# Altium schematic sheet LTE+GPS.SchDoc
size 420 x 297 mm
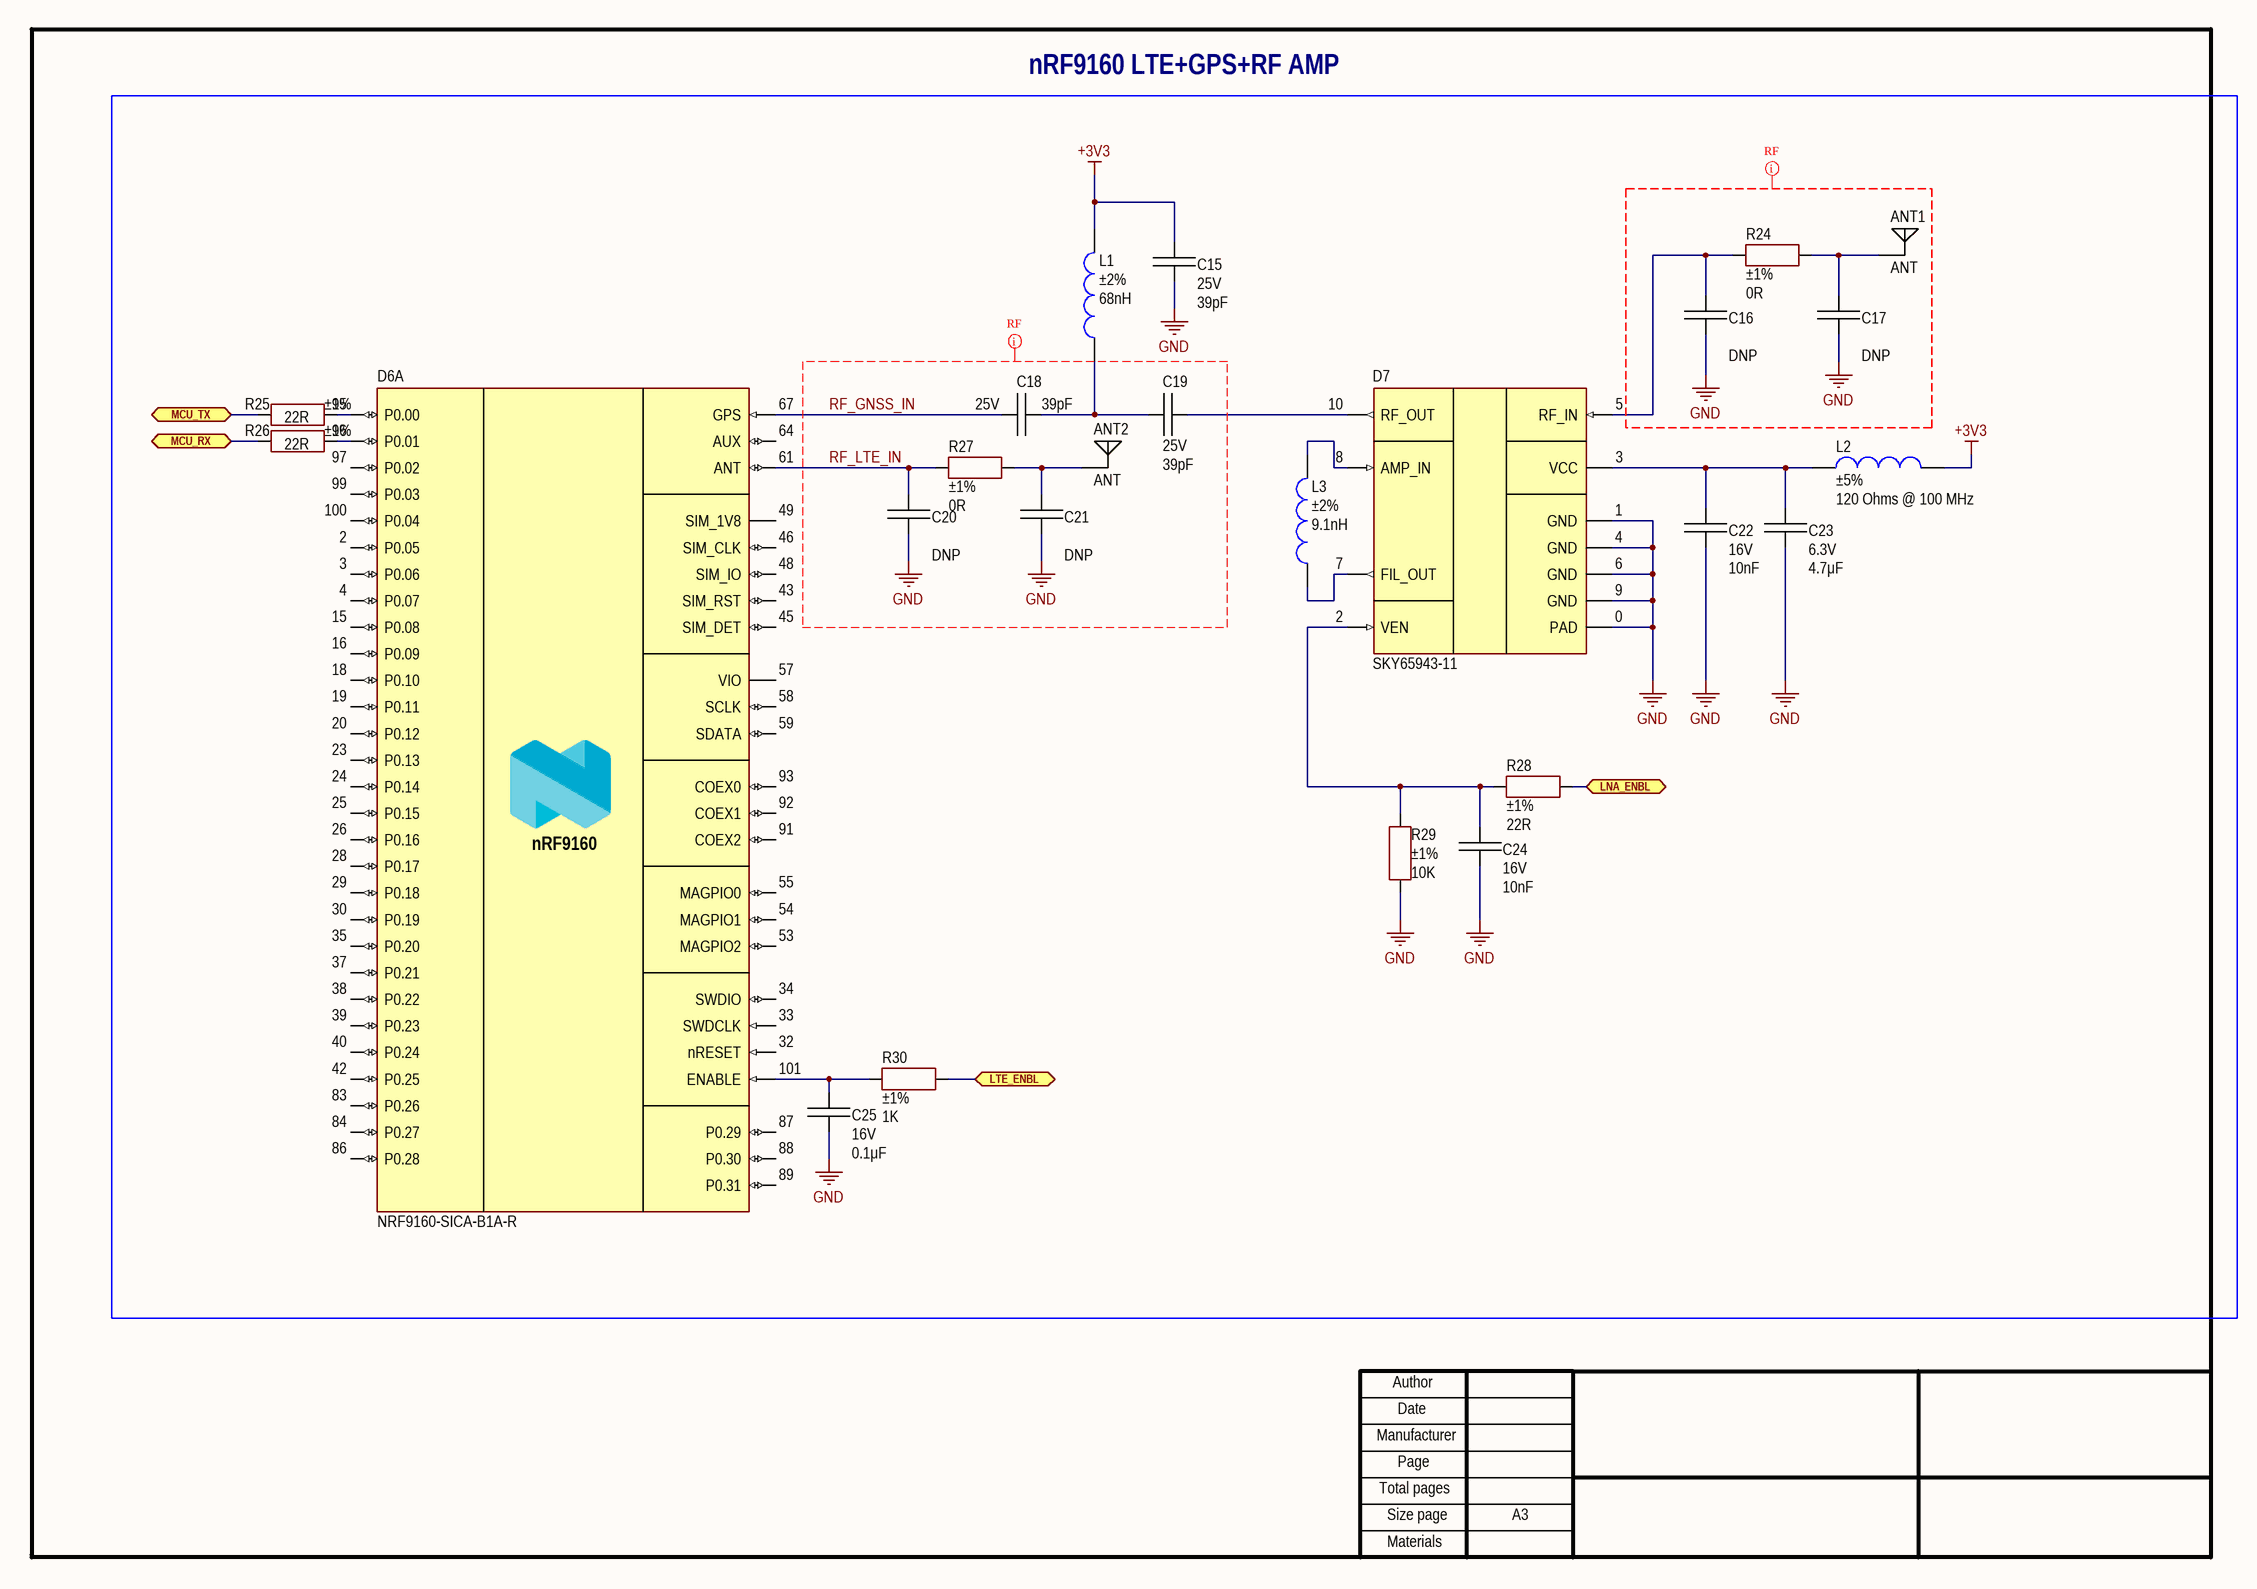
[diagram p0: LTE+GPS.SchDoc]

## Parts
ANT1  CommentText: ANT  [ANT: ANT2012LL00R2400A]
ANT2  CommentText: ANT  [ANT: ANT2012LL00R2400A]
C15  value 39pF  Voltage: 25V  [CAP: 0201]
C16  value DNP  [CAP: 0201]
C17  value DNP  [CAP: 0201]
C18  value 39pF  Voltage: 25V  [CAP: 0201]
C19  value 39pF  Voltage: 25V  [CAP: 0201]
C20  value DNP  [CAP: 0201]
C21  value DNP  [CAP: 0201]
C22  value 10nF  Voltage: 16V  [CAP: 0201]
C23  value 4.7μF  Voltage: 6.3V  [CAP: 0603_NO_SILK]
C24  value 10nF  Voltage: 16V  [CAP: 0201]
C25  value 0.1μF  Voltage: 16V  [CAP: 0402_NO_SILK]
D6  PartNumber: NRF9160-SICA-B1A-R  [MOD: NRF9160]  (part A of 3)
D7  (no value)  [IC: SKY65943-11]
L1  value 68nH  Tolerance: ±2%  [IND: 0402]
L2  value 120 Ohms @ 100 MHz  Tolerance: ±5%  [IND: 0402]
L3  value 9.1nH  Tolerance: ±2%  [IND: 0402]
R24  value 0R  Tolerance: ±1%  [RES: 0201]
R25  value 22R  Tolerance: ±1%  [RES: 0201]
R26  value 22R  Tolerance: ±1%  [RES: 0201]
R27  value 0R  Tolerance: ±1%  [RES: 0201]
R28  value 22R  Tolerance: ±1%  [RES: 0201]
R29  value 10K  Tolerance: ±1%  [RES: 0201]
R30  value 1K  Tolerance: ±1%  [RES: 0201]

## Blocks framed on the sheet
nRF9160 LTE+GPS+RF AMP: ANT1 ANT2 C15-C25 D6 D7 L1-L3 R24-R30

## Ports
LNA_ENBL (bidir), LTE_ENBL (bidir), MCU_RX (bidir), MCU_TX (bidir)

## Nets
+3V3: C15.1 L1.1 L2.1
GND: C15.2 C16.1 C17.1 C20.1 C21.1 C22.1 C23.1 C24.1 C25.1 D7.0(PAD) D7.1(GND) D7.4(GND) D7.6(GND) D7.9(GND) R29.1
LNA_ENBL: R28.2 ; port LNA_ENBL
LTE_ENBL: R30.1 ; port LTE_ENBL
MCU_RX: R26.2 ; port MCU_RX
MCU_TX: R25.2 ; port MCU_TX
RF_GNSS_IN: C18.2 D6.67(GPS)
RF_LTE_IN: C20.2 D6.61(ANT) R27.2
NetANT1_1: ANT1.1 C17.2 R24.1
NetANT2_1: ANT2.1 C21.2 R27.1
NetC16_2: C16.2 D7.5(RF_IN) R24.2
NetC18_1: C18.1 C19.2 L1.2
NetC19_1: C19.1 D7.10(RF_OUT)
NetC22_2: C22.2 C23.2 D7.3(VCC) L2.2
NetC24_2: C24.2 D7.2(VEN) R28.1 R29.2
NetC25_2: C25.2 D6.101(ENABLE) R30.2
NetD6_95: D6.95(P0.00) R25.1
NetD6_96: D6.96(P0.01) R26.1
NetD7_7: D7.7(FIL_OUT) L3.2
NetD7_8: D7.8(AMP_IN) L3.1

Not connected (* = marked no-connect by the designer): D6 2(P0.05) 3(P0.06) 4(P0.07) 15(P0.08) 16(P0.09) 18(P0.10) 19(P0.11) 20(P0.12) 23(P0.13) 24(P0.14) 25(P0.15) 26(P0.16) 28(P0.17) 29(P0.18) 30(P0.19) 32(nRESET) 33(SWDCLK) 34(SWDIO) 35(P0.20) 37(P0.21) 38(P0.22) 39(P0.23) 40(P0.24) 42(P0.25) 43(SIM_RST) 45(SIM_DET) 46(SIM_CLK) 48(SIM_IO) 49(SIM_1V8) 53(MAGPIO2) 54(MAGPIO1) 55(MAGPIO0) 57(VIO) 58(SCLK) 59(SDATA) 64(AUX) 83(P0.26) 84(P0.27) 86(P0.28) 87(P0.29) 88(P0.30) 89(P0.31) 91(COEX2) 92(COEX1) 93(COEX0) 97(P0.02) 99(P0.03) 100(P0.04)

## Layout directives
net class RF: GND, RF_GNSS_IN, RF_LTE_IN

## Notes on the sheet
- Author
- Manufacturer
- Date
- Page
- Total pages
- Size page
- A3
- Materials

## Library data of the parts
ANT1 ANT2 = ANT2012LL00R2400A: 2.45GHz Bluetooth, ISM, Wi-Fi, Zigbee Chip RF Antenna 2.4GHz ~ 2.5GHz 3.77dBi Solder Surface Mount; Manufacturer: Yageo; ValueManufacturerPartNumber: Ceramic antenna, 2x1.25mm; HelpURL: https://www.digikey.com/en/products/detail/yageo/ANT2012LL00R2400A/9360375; Type: Ceramic antenna; PartNumber: ANT2012LL00R2400A; Package: 2x1.25mm
C15 C18 C19 = Ceramic_0201: 39 pF ±5% 25V Ceramic Capacitor C0G, NP0 0201 (0603 Metric); Manufacturer: Murata Electronics; PartNumber: GRM0335C1E390JA01D; ValueManufacturerPartNumber: Ceramic capacitor, 39pF, NP0, ±5%, 25V, 0201, -55...+125°C; Package: 0201; HelpURL: https://www.digikey.com/en/products/detail/murata-electronics/GRM0335C1E390JA01D/4358216; Temperature: -55...+125°C; TypeCapacitor: Ceramic capacitor; Tolerance: ±5%; TypeDielectric: NP0
C16 C17 C20 C21 = Ceramic_0201: DNP; ValueManufacturerPartNumber: Ceramic capacitor, DNP, , , , 0201, -55...+125°C; TypeCapacitor: Ceramic capacitor; Package: 0201; Temperature: -55...+125°C
C22 C24 = Ceramic_0201: 10000 pF ±10% 16V Ceramic Capacitor X7R 0201 (0603 Metric); Manufacturer: Yageo; PartNumber: CC0201KRX7R7BB103; ValueManufacturerPartNumber: Ceramic capacitor, 10nF, X7R, ±10%, 16V, 0201, -55...+125°C; Package: 0201; HelpURL: https://www.digikey.com/en/products/detail/yageo/CC0201KRX7R7BB103/2833569; Temperature: -55...+125°C; TypeCapacitor: Ceramic capacitor; Tolerance: ±10%; TypeDielectric: X7R
C23 = Ceramic_0603: 4.7 µF ±20% 6.3V Ceramic Capacitor X7R 0603 (1608 Metric); Manufacturer: Yageo; PartNumber: CC0603MRX7R5BB475; ValueManufacturerPartNumber: Ceramic capacitor, 4.7μF, X7R, ±10%, 6.3V, 0603, -55...+125°C; Tolerance: ±10%; Package: 0603; HelpURL: https://www.digikey.com/en/products/detail/yageo/CC0603MRX7R5BB475/7164380; Temperature: -55...+125°C; TypeCapacitor: Ceramic capacitor; TypeDielectric: X7R
C25 = Ceramic_0402: 0.1 µF ±10% 16V Ceramic Capacitor X7R 0402 (1005 Metric); Manufacturer: Yageo; PartNumber: CC0402KRX7R7BB104; ValueManufacturerPartNumber: Ceramic capacitor, 0.1μF, X7R, ±10%, 16V, 0402, -55...+125°C; Package: 0402; HelpURL: https://www.digikey.com/product-detail/en/yageo/CC0402KRX7R7BB104/311-1338-1-ND/2103122; Temperature: -55...+125°C; TypeCapacitor: Ceramic capacitor; Tolerance: ±10%; TypeDielectric: X7R
D6 = nRF9160: LTE/GSM module; Manufacturer: Nordic Semiconductor; Supply: 3...5.5V; Frequency: 2.4GHz; TypeProtocol: LTE-M/NB-IoT/GPS; HelpURL: https://www.digikey.com/en/products/detail/nordic-semiconductor-asa/NRF9160-SICA-B1A-R/13533595; Package: 127-LGA; ComponentType: LTE/GSM module; ValueManufacturerPartNumber: =ComponentType+', '+TypeProtocol+', '+Frequency+', '+CoreSize+', '+CoreProcessor+', '+MemoryROM+', '+MemoryRAM+', '+Supply+', '+Temperature+', '+Package; Temperature: -40...+85°C
D7 = SKY65943-11: RF front-end; Manufacturer: Skyworks Solutions; ValueManufacturerPartNumber: IC RF amplifier, 2.7 GHz, 19dB, -40...+125°C, 10-SMD Module; Gain: 19dB; Frequency: 2.7 GHz; HelpURL: https://www.digikey.com/en/products/detail/skyworks-solutions-inc/SKY65943-11/9603434; Package: 10-SMD Module; ComponentType: IC RF amplifier; Temperature: -40...+125°C; PartNumber: SKY65943-11
L1 = Inductor_0402: 68 nH Unshielded Wirewound Inductor 320 mA 1.1Ohm Max 0402 (1005 Metric); Manufacturer: Murata Electronics; PartNumber: LQW15AN68NG80D; ValueManufacturerPartNumber: Fixed inductor, 68nH, ±2%, 0402, 0.32A, -55...+125°C; TypeInductor: Fixed inductor; MaxCurrent: 0.32A; Package: 0402; HelpURL: https://www.digikey.com/en/products/detail/murata-electronics/LQW15AN68NG80D/4864887; Temperature: -55...+125°C
L2 = Inductor_0402: 120 Ohms @ 100 MHz 1 Power Line Ferrite Bead 0402 (1005 Metric) 2A 55mOhm; Manufacturer: Murata Electronics; PartNumber: BLM15PX121SN1D; ValueManufacturerPartNumber: Fixed inductor, 120 Ohms @ 100 MHz, ±5%, 0402, 2A, -55...+125°C; TypeInductor: Fixed inductor; Package: 0402; HelpURL: https://www.digikey.com/en/products/detail/murata-electronics/BLM15PX121SN1D/4421095; Temperature: -55...+125°C; MaxCurrent: 2A
L3 = Inductor_0402: 9.1 nH Unshielded Wirewound Inductor 1.4 A 80mOhm Max 0402 (1005 Metric); Manufacturer: Murata Electronics; PartNumber: LQW15AN9N1G8ZD; ValueManufacturerPartNumber: Fixed inductor, 9.1nH, ±2%, 0402, 1.4A, -55...+125°C; TypeInductor: Fixed inductor; MaxCurrent: 1.4A; Package: 0402; HelpURL: https://www.digikey.com/en/products/detail/murata-electronics/LQW15AN9N1G8ZD/6799034; Temperature: -55...+125°C
R24 R27 = Resistor_0201: 0 Ohms Jumper 0.05W, 1/20W Chip Resistor 0201 (0603 Metric) Moisture Resistant Thick Film; Manufacturer: Yageo; PartNumber: RC0201FR-070RL; ValueManufacturerPartNumber: Resistor film, 0R, ±1%, 0201, 0.05W, -55...+125°C; TypeResistor: Resistor film; Package: 0201; HelpURL: https://www.digikey.com/en/products/detail/yageo/RC0201FR-070RL/1948858; Temperature: -55...+125°C; Power: 0.05W
R25 R26 R28 = Resistor_0201: 22 Ohms ±1% 0.05W, 1/20W Chip Resistor 0201 (0603 Metric) Moisture Resistant Thick Film; Manufacturer: Yageo; PartNumber: RC0201FR-0722RL; ValueManufacturerPartNumber: Resistor film, 22R, ±1%, 0201, 0.05W, -55...+125°C; TypeResistor: Resistor film; Package: 0201; HelpURL: https://www.digikey.com/en/products/detail/yageo/RC0201FR-0722RL/5280378; Temperature: -55...+125°C; Power: 0.05W
R29 = Resistor_0201: 10 kOhms ±1% 0.05W, 1/20W Chip Resistor 0201 (0603 Metric) Moisture Resistant Thick Film; Manufacturer: Yageo; PartNumber: RC0201JR-0710KL; ValueManufacturerPartNumber: Resistor film, 10K, ±1%, 0201, 0.05W, -55...+125°C; TypeResistor: Resistor film; Package: 0201; HelpURL: https://www.digikey.com/en/products/detail/yageo/RC0201FR-0710KL/1948870; Temperature: -55...+125°C; Power: 0.05W
R30 = Resistor_0201: 1 kOhms ±1% 0.05W, 1/20W Chip Resistor 0201 (0603 Metric) Moisture Resistant Thick Film; Manufacturer: Yageo; PartNumber: RC0201JR-071KL; ValueManufacturerPartNumber: Resistor film, 1K, ±1%, 0201, 0.05W, -55...+125°C; TypeResistor: Resistor film; Package: 0201; HelpURL: https://www.digikey.com/en/products/detail/yageo/RC0201FR-071KL/3202389; Temperature: -55...+125°C; Power: 0.05W